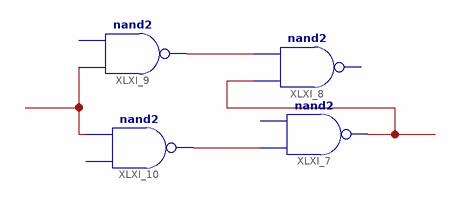
[diagram p0: schematic sheet 1]
// Xilinx ISE schematic Ejemplo.sch (virtex5) as structural Verilog: 4 symbols, 0 ports
module Ejemplo (
);

  wire negq, XLXN_4, XLXN_5, XLXN_8;

  not XLXI_7 (negq, XLXN_5);  // nand2 open: I1
  // nand2 XLXI_8 has open pins: I0=negq, I1=XLXN_4, O=open
  not XLXI_9 (XLXN_4, XLXN_8);  // nand2 open: I1
  not XLXI_10 (XLXN_5, XLXN_8);  // nand2 open: I0
endmodule
